# Altium project WirelessPCB.PrjPCB
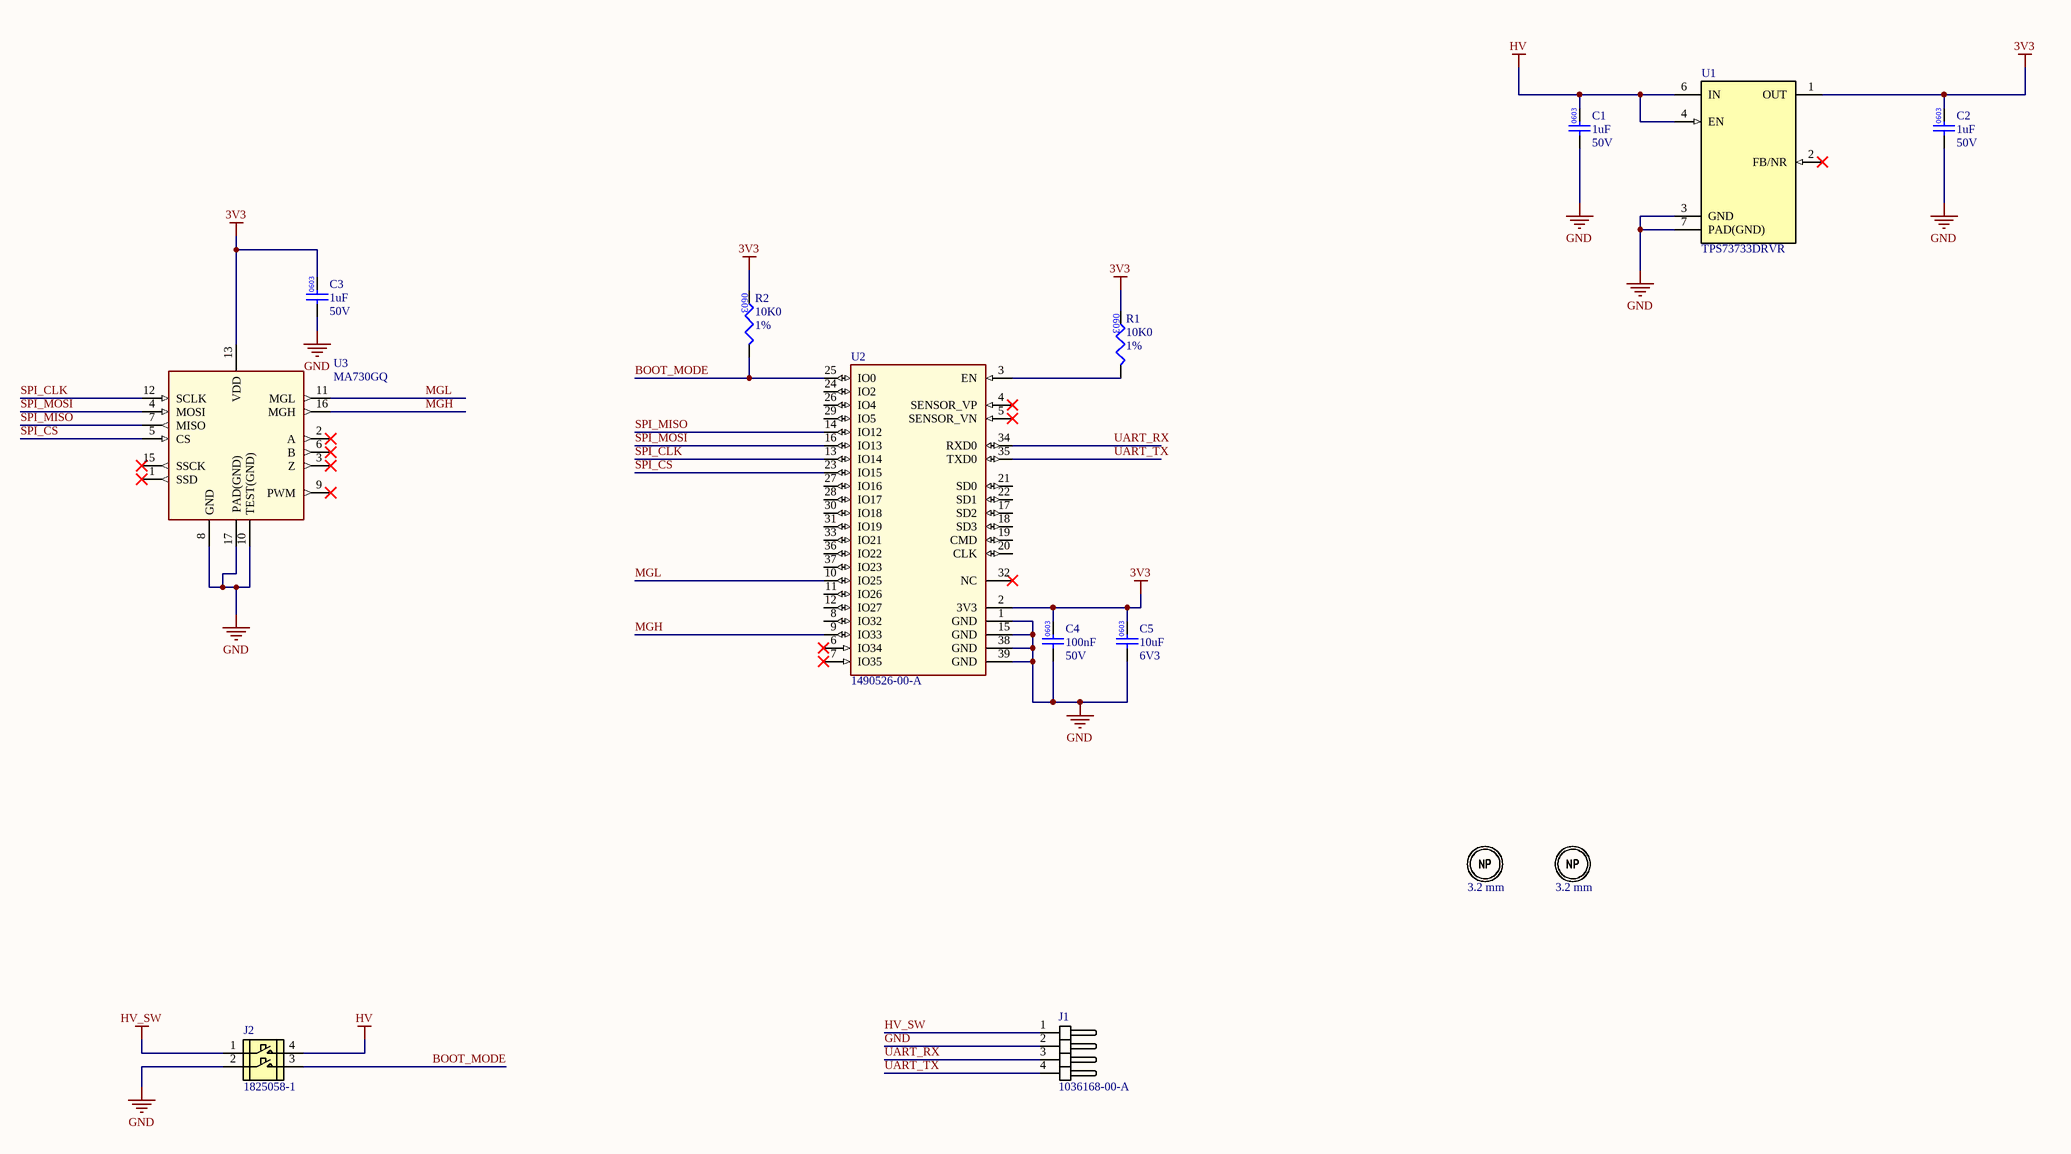
[diagram p0: WirelessPCB-Micro.SchDoc]
1 sheet, 14 parts. Net scope: global (net labels, ports and power ports of the same name join across sheets).
Board file: WirelessPCB.PcbDoc

## Sheet WirelessPCB-Micro.SchDoc
size A2; PageSetup: Record=PageOptions|CenterHorizontal=True|CenterVertical=True|PrintScale=0.96|XCorrection=1.00|YCorrection=1.00|PrintKind=2|BorderSize=5000000|LeftOffset=0|BottomOffset=0|Orientation=2|PaperLength=4318|PaperWidth=2794|Scale=100|PaperSource=15|PrintQuality=600|MediaType=1|DitherType=10|PaperKind=11x17|PrintScaleMode=1

### Parts
C1  value 1uF  Voltage: 50V  [CAPC1608X80N]  (hidden comment: 1034454-00-A)
C2  value 1uF  Voltage: 50V  [CAPC1608X80N]  (hidden comment: 1034454-00-A)
C3  value 1uF  Voltage: 50V  [CAPC1608X80N]  (hidden comment: 1034454-00-A)
C4  value 100nF  Voltage: 50V  [CAPC1608X80N]  (hidden comment: 2005100)
C5  value 10uF  Voltage: 6V3  [CAPC1608X80N]  (hidden comment: 1054400-00-A)
J1  1036168-00-A  [MOLEX_22-28-4043]
J2  Manufacturer PartNo: 1825058-1  [SWITCH-TE-1825058-1]  (hidden comment: 1115379-00-A)
M1  DIAMETER: 3.2 mm  [MTG320]  (hidden comment: MOUNTING HOLE UNPLATED 3.2 MM)  (no BOM)
M2  DIAMETER: 3.2 mm  [MTG320]  (hidden comment: MOUNTING HOLE UNPLATED 3.2 MM)  (no BOM)
R1  value 10K0  Tolerance: 1%  [RESC1608X50N]  (hidden comment: 2000015)
R2  value 10K0  Tolerance: 1%  [RESC1608X50N]  (hidden comment: 2000015)
U1  Manufacturer PartNo: TPS73733DRVR  [SON65P200X200X80-7AN]  (hidden comment: 1517151-00-A)
U2  1490526-00-A  [MODULE-ESPRESSIF-ESP32-WROOM-32]
U3  Manufacturer PartNo: MA730GQ  [QFN50P300X300X100_HS-17N]  (hidden comment: 1483744-00-A)

### Nets
3V3: C2.1 C3.1 C4.1 C5.1 R1.1 R2.1 U1.1(OUT) U2.2(3V3) U3.13(VDD)
GND: C1.2 C2.2 C3.2 C4.2 C5.2 J1.2 J2.2 U1.3(GND) U1.7(PAD(GND)) U2.1(GND) U2.15(GND) U2.38(GND) U2.39(GND) U3.8(GND) U3.10(TEST(GND)) U3.17(PAD(GND))
HV: C1.1 J2.4 U1.4(EN) U1.6(IN)
HV_SW: J1.1 J2.1
BOOT_MODE: J2.3 R2.2 U2.25(IO0)
MGH: U2.9(IO33) U3.16(MGH)
MGL: U2.10(IO25) U3.11(MGL)
SPI_CLK: U2.13(IO14) U3.12(SCLK)
SPI_CS: U2.23(IO15) U3.5(CS)
SPI_MISO: U2.14(IO12) U3.7(MISO)
SPI_MOSI: U2.16(IO13) U3.4(MOSI)
UART_RX: J1.3 U2.34(RXD0)
UART_TX: J1.4 U2.35(TXD0)
NetR1_2: R1.2 U2.3(EN)

Not connected (* = marked no-connect by the designer): U1 2(FB/NR)*; U2 4(SENSOR_VP)* 5(SENSOR_VN)* 6(IO34)* 7(IO35)* 8(IO32) 11(IO26) 12(IO27) 17(SD2) 18(SD3) 19(CMD) 20(CLK) 21(SD0) 22(SD1) 24(IO2) 26(IO4) 27(IO16) 28(IO17) 29(IO5) 30(IO18) 31(IO19) 32(NC)* 33(IO21) 36(IO22) 37(IO23); U3 1(SSD)* 2(A)* 3(Z)* 6(B)* 9(PWM)* 15(SSCK)*

### Notes on the sheet
- Title
- Size:
- Date:
- File:
- A2
- Number:
- Time:
- Revision:
- Sheet
- of
- (in symbol CMP-00102-8) 0603
- (in symbol CMP-00111-10) 0603
- (in symbol CMP-00163-8) 0603
- (in symbol CMP-02462-8) 0603

### Library data of the parts
C1-C3 = CMP-00102-8: CAPACITOR 0603(1608) 1uF X5R 50V  [AEC-Q]; Manufacturer: TDK; Manufacturer PartNo: CGA3E3X5R1H105K080AB; AEC-Q: YES; Level: 1; Pressfit: NO; Selective Soldering: NO; Sherlock Type: CAPACITOR CERAMIC; Part Number: 1034454-00-A; Dielectric: X5R; Package: 0603(1608); Rohs: NO; SAP: 1034454-00-A; Washable: YES; ClassName: *; Grouping: *; Layout Notes: *; Part Notes: *; PPAP: -; Preferred: YES; Price: 0; SupplyChain: -
C4 = CMP-00163-8: CAP,X5R,0.47UF,50V,10%,0603(1608); Manufacturer: MURATA; Manufacturer PartNo: GRM188R71H104KA93D; Dielectric: X7R; Level: 1; Washable: YES; AEC-Q: NO; Pressfit: NO; Sherlock Type: CAPACITOR CERAMIC; Part Number: 2005100; Package: 0603(1608); Rohs: NO; SAP: 2005100; ClassName: *; Grouping: *; Layout Notes: *; Part Notes: *; PPAP: -; Preferred: YES; Price: 0; Selective Soldering: NO; SupplyChain: -
C5 = CMP-00111-10: CAPACITOR 0603(1608) 10uF X5R 6V3  [AEC-Q]; Manufacturer: KEMET; Manufacturer PartNo: C0603C106M9PAC; Part Notes: USE 2004011; Washable: YES; Selective Soldering: NO; Level: 1; Pressfit: NO; Sherlock Type: CAPACITOR CERAMIC; Part Number: 1054400-00-A; Dielectric: X5R; Package: 0603(1608); Rohs: NO; SAP: 1054400-00-A; ClassName: *; AEC-Q: YES; Grouping: *; Layout Notes: *; Preferred: YES; PPAP: -; Price: 0; SupplyChain: -
J1 = CMP-00881-5: HEADER BREAKABLE 1X4 PINS GOLD FLASH; MANUFACTURER: MOLEX; selective soldering: YES; LEVEL: 1; PITCH: 2.54 mm (100mils); Angle: VERTICAL; SchLibComponentName: CON_MOLEX_22-28-4043; SAP: 1036168-00-A; Manufacturer Partno: 22-28-4043; TYPE: CONNECTOR; PLATING: GOLD; PINCOUNT: 4; ROWS: 1; ROHS: YES; WASHABLE: YES; ClassName: *; Grouping: *; Layout Notes: *; Part Notes: *; Preferred: *; Part Number: 1036168-00-A
J2 = CMP-08810-1: SW,DIP,SPST,2POS,0.1A,24VDC,SM; Manufacturer: TE; AEC-Q: YES; Level: 1; Pressfit: NO; Selective Soldering: NO; ClassName: *; Grouping: *; Layout Notes: *; Package: DIP-6; Part Notes: *; Part Number: 1115379-00-A; Preferred: YES; RoHS: YES; SAP: 1115379-00-A; Sherlock Type: *; Washable: YES
M1 M2 = CMP-01416-A.4: SAP: BOARD_FEATURE; Part Number: BOARD_FEATURE
R1 R2 = CMP-02462-8: RESISTOR 0603(1608) 10K0 1% 1/10W; Manufacturer PartNo: CRCW06031002FKTA; Manufacturer: Vishay; Level: 1; Washable: YES; Preferred: NO; Pressfit: NO; Replaced By: 1114330-00-A; Part Number: 2000015; Wattage: 1/10W; Package: 0603(1608); Rohs: No; SAP: 2000015; Grouping: *; ClassName: *; Part Notes: *; Layout Notes: *; AEC-Q: YES; Selective Soldering: NO; Sherlock Type: RESISTOR
U1 = CMP-16621-2: IC,VOLT-REG,LDO,3.3V,1A,WSON6,AEC-Q; Manufacturer: Texas Instruments; AEC-Q: YES; Level: 1; Pressfit: NO; Selective Soldering: NO; ClassName: *; Grouping: *; Layout Notes: *; Package: *; Part Notes: *; Part Number: 1517151-00-A; Preferred: YES; RoHS: YES; SAP: 1517151-00-A; Sherlock Type: IC; Washable: YES; PPAP: -; Price: 0; SupplyChain: -; LongDescription: -
U2 = CMP-14064-1: MODULE,WIFI/BLE,150MBPS,ESP32,SMD-38; Manufacturer: Espressif Systems; Manufacturer PartNo: ESP32-WROOM-32; AEC-Q: NO; Level: 1; Preferred: YES; Pressfit: NO; Sherlock Type: IC; ClassName: *; Grouping: *; Layout Notes: *; Package: *; Part Notes: *; Part Number: 1490526-00-A; RoHS: YES; SAP: 1490526-00-A; Selective Soldering: NO; Washable: YES
U3 = CMP-13750-4: IC,ANGLE SNSR,14-BIT,MA730,QFN16; Manufacturer: MPS; AEC-Q: NO; Level: 1; Preferred: YES; Pressfit: NO; ClassName: *; Grouping: *; Layout Notes: *; Package: QFN; Part Notes: *; Part Number: 1483744-00-A; RoHS: YES; SAP: 1483744-00-A; Selective Soldering: NO; Sherlock Type: IC; Washable: YES

## Assembly variants
WirelessPCB: not fitted J1